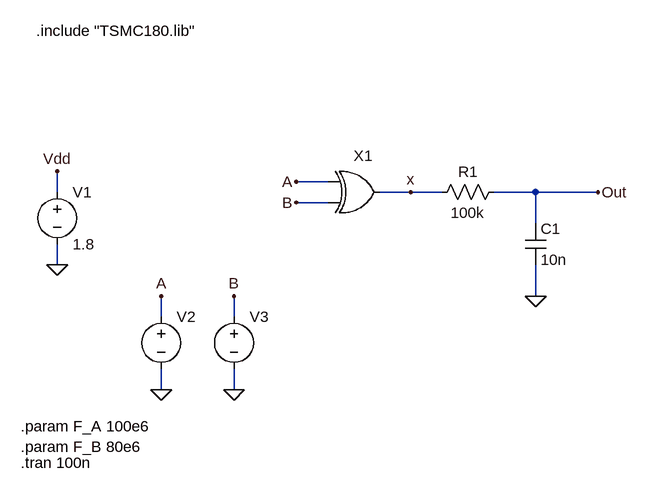
[diagram p0: schematic phase_detector_xor.asc]
phase_detector_xor.asc, the LTspice schematic file:
Version 4
SHEET 1 1392 680
WIRE 768 160 720 160
WIRE 352 176 352 144
WIRE 896 176 848 176
WIRE 944 176 896 176
WIRE 1088 176 1024 176
WIRE 1184 176 1088 176
WIRE 768 192 720 192
WIRE 1088 224 1088 176
WIRE 352 288 352 256
WIRE 1088 336 1088 288
WIRE 512 368 512 336
WIRE 624 368 624 336
WIRE 512 480 512 448
WIRE 624 480 624 448
FLAG 352 288 0
FLAG 352 144 Vdd
FLAG 720 160 A
FLAG 720 192 B
FLAG 1088 336 0
FLAG 1184 176 Out
FLAG 512 480 0
FLAG 512 336 A
FLAG 624 480 0
FLAG 624 336 B
FLAG 896 176 x
SYMBOL voltage 352 160 R0
WINDOW 123 0 0 Left 0
WINDOW 39 0 0 Left 0
SYMATTR InstName V1
SYMATTR Value 1.8
SYMBOL xor 816 112 R0
SYMATTR InstName X1
SYMBOL res 1040 160 R90
WINDOW 0 0 56 VBottom 2
WINDOW 3 32 56 VTop 2
SYMATTR InstName R1
SYMATTR Value 100k
SYMBOL cap 1072 224 R0
SYMATTR InstName C1
SYMATTR Value 10n
SYMBOL voltage 512 352 R0
WINDOW 123 0 0 Left 0
WINDOW 39 0 0 Left 0
WINDOW 3 24 96 Invisible 2
SYMATTR Value PULSE(0 1.8 0 10p 10p {1/(2*F_A)} {1/F_A})
SYMATTR InstName V2
SYMBOL voltage 624 352 R0
WINDOW 123 0 0 Left 0
WINDOW 39 0 0 Left 0
WINDOW 3 24 96 Invisible 2
SYMATTR Value PULSE(0 1.8 0 10p 10p {1/(2*F_B)} {1/F_B})
SYMATTR InstName V3
TEXT 320 -72 Left 2 !.include "TSMC180.lib"
TEXT 296 536 Left 2 !.param F_A 100e6
TEXT 296 568 Left 2 !.param F_B 80e6
TEXT 296 592 Left 2 !.tran 100n

The netlist it stands for:
* phase_detector_xor.asc
V1 Vdd 0 1.8
XX1 A B x xor VDD=1.8 L_INV=0.18u LD=0.48u WN_INV=0.42u WPFACT=1.5 L_TG=0.18u W_TG=0.42u  ; pins A B OUT
R1 Out x 100k
C1 Out 0 10n
V2 A 0 PULSE(0 1.8 0 10p 10p {1/(2*F_A)} {1/F_A})
V3 B 0 PULSE(0 1.8 0 10p 10p {1/(2*F_B)} {1/F_B})
.include "TSMC180.lib"
.param F_A 100e6
.param F_B 80e6
.tran 100n
.backanno
.end